# Altium schematic sheet DIOBoard1.SchDoc: DIO Board 1
size A4; Author: YIng Zuo; Revision: 1.0
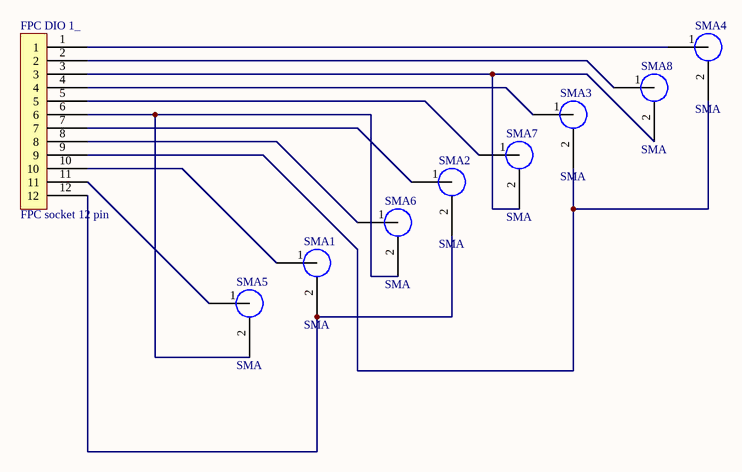
[diagram p0: DIOBoard1.SchDoc]

## Parts
FPC_DIO_1_  FPC socket 12 pin  [FPC 12pin]
SMA1  SMA  [SMA]
SMA2  SMA  [SMA]
SMA3  SMA  [SMA]
SMA4  SMA  [SMA]
SMA5  SMA  [SMA]
SMA6  SMA  [SMA]
SMA7  SMA  [SMA]
SMA8  SMA  [SMA]

## Nets
NetFPC_DIO_1__1: FPC_DIO_1_.1 SMA4.1(Core)
NetFPC_DIO_1__2: FPC_DIO_1_.2 SMA8.1(Core)
NetFPC_DIO_1__3: FPC_DIO_1_.3 SMA7.2(Ground) SMA8.2(Ground)
NetFPC_DIO_1__4: FPC_DIO_1_.4 SMA3.1(Core)
NetFPC_DIO_1__5: FPC_DIO_1_.5 SMA7.1(Core)
NetFPC_DIO_1__6: FPC_DIO_1_.6 SMA5.2(Ground) SMA6.2(Ground)
NetFPC_DIO_1__7: FPC_DIO_1_.7 SMA2.1(Core)
NetFPC_DIO_1__8: FPC_DIO_1_.8 SMA6.1(Core)
NetFPC_DIO_1__9: FPC_DIO_1_.9 SMA3.2(Ground) SMA4.2(Ground)
NetFPC_DIO_1__10: FPC_DIO_1_.10 SMA1.1(Core)
NetFPC_DIO_1__11: FPC_DIO_1_.11 SMA5.1(Core)
NetFPC_DIO_1__12: FPC_DIO_1_.12 SMA1.2(Ground) SMA2.2(Ground)

## Notes on the sheet
- Title
- Size:
- Date:
- A4
- Number:
- Time:
- Revision:
- Sheet
- of
- File: